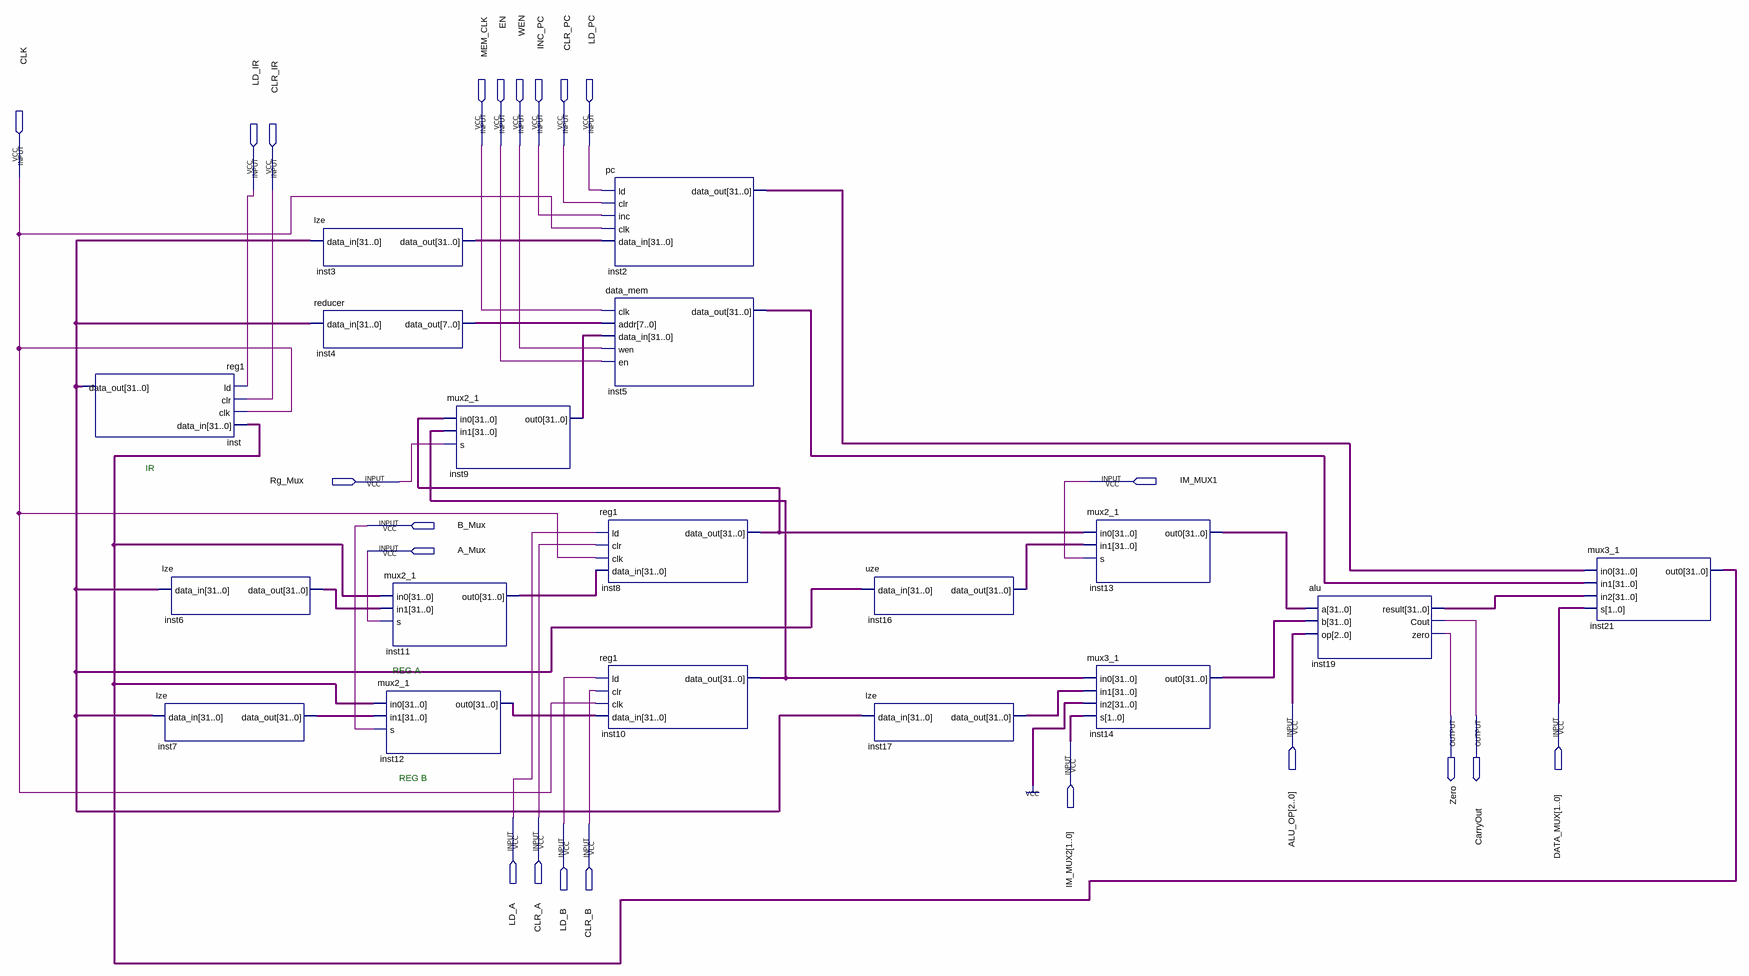
[diagram p0: schematic sheet]
// Quartus schematic lab4b.bdf as structural Verilog: 18 symbols, 22 pins
module lab4b (
  input  MEM_CLK,
  input  EN,
  input  WEN,
  input  INC_PC,
  input  CLR_PC,
  input  LD_PC,
  input  CLK,
  input  LD_IR,
  input  CLR_IR,
  input  Rg_Mux,
  input  IM_MUX1,
  input  B_Mux,
  input  A_Mux,
  input  [2:0] ALU_OP,
  input  [1:0] DATA_MUX,
  input  [1:0] IM_MUX2,
  input  LD_A,
  input  CLR_A,
  input  LD_B,
  input  CLR_B,
  output Zero,
  output CarryOut
);

  wire [7:0] inst4_data_out;
  wire [31:0] inst2_data_out, inst3_data_out, inst5_data_out, inst6_data_out, inst7_data_out, inst8_data_out,
       inst9_out0, inst10_data_out, inst11_out0, inst12_out0, inst13_out0, inst14_out0, inst16_data_out,
       inst17_data_out, inst19_result, inst21_out0, inst_data_out;

  reg1 inst (.ld(LD_IR), .clr(CLR_IR), .clk(CLK), .data_in(inst21_out0), .data_out(inst_data_out));
  lze inst6 (.data_in(inst_data_out), .data_out(inst6_data_out));
  lze inst7 (.data_in(inst_data_out), .data_out(inst7_data_out));
  lze inst3 (.data_in(inst_data_out), .data_out(inst3_data_out));
  reducer inst4 (.data_in(inst_data_out), .data_out(inst4_data_out));
  mux2_1 inst12 (.in0(inst21_out0), .in1(inst7_data_out), .s(B_Mux), .out0(inst12_out0));
  mux2_1 inst11 (.in0(inst21_out0), .in1(inst6_data_out), .s(A_Mux), .out0(inst11_out0));
  mux2_1 inst9 (.in0(inst8_data_out), .in1(inst10_data_out), .s(Rg_Mux), .out0(inst9_out0));
  pc inst2 (.ld(LD_PC), .clr(CLR_PC), .inc(INC_PC), .clk(CLK), .data_in(inst3_data_out), .data_out(inst2_data_out));
  data_mem inst5 (
    .clk(MEM_CLK), .addr(inst4_data_out), .data_in(inst9_out0), .wen(WEN), .en(EN), .data_out(inst5_data_out));
  reg1 inst8 (.ld(LD_A), .clr(CLR_A), .clk(CLK), .data_in(inst11_out0), .data_out(inst8_data_out));
  reg1 inst10 (.ld(LD_B), .clr(CLR_B), .clk(CLK), .data_in(inst12_out0), .data_out(inst10_data_out));
  uze inst16 (.data_in(inst_data_out), .data_out(inst16_data_out));
  lze inst17 (.data_in(inst_data_out), .data_out(inst17_data_out));
  mux2_1 inst13 (.in0(inst8_data_out), .in1(inst16_data_out), .s(IM_MUX1), .out0(inst13_out0));
  mux3_1 inst14 (.in0(inst10_data_out), .in1(inst17_data_out), .in2({32{1'b1}}), .s(IM_MUX2), .out0(inst14_out0));
  alu inst19 (.a(inst13_out0), .b(inst14_out0), .op(ALU_OP), .result(inst19_result), .Cout(CarryOut), .zero(Zero));
  mux3_1 inst21 (.in0(inst2_data_out), .in1(inst5_data_out), .in2(inst19_result), .s(DATA_MUX), .out0(inst21_out0));

  // Notes on the sheet:
  //   IR   
  //   REG A       
  //   REG B      
endmodule
